# EAGLE schematic replica61 (EAGLE 7.4.0)
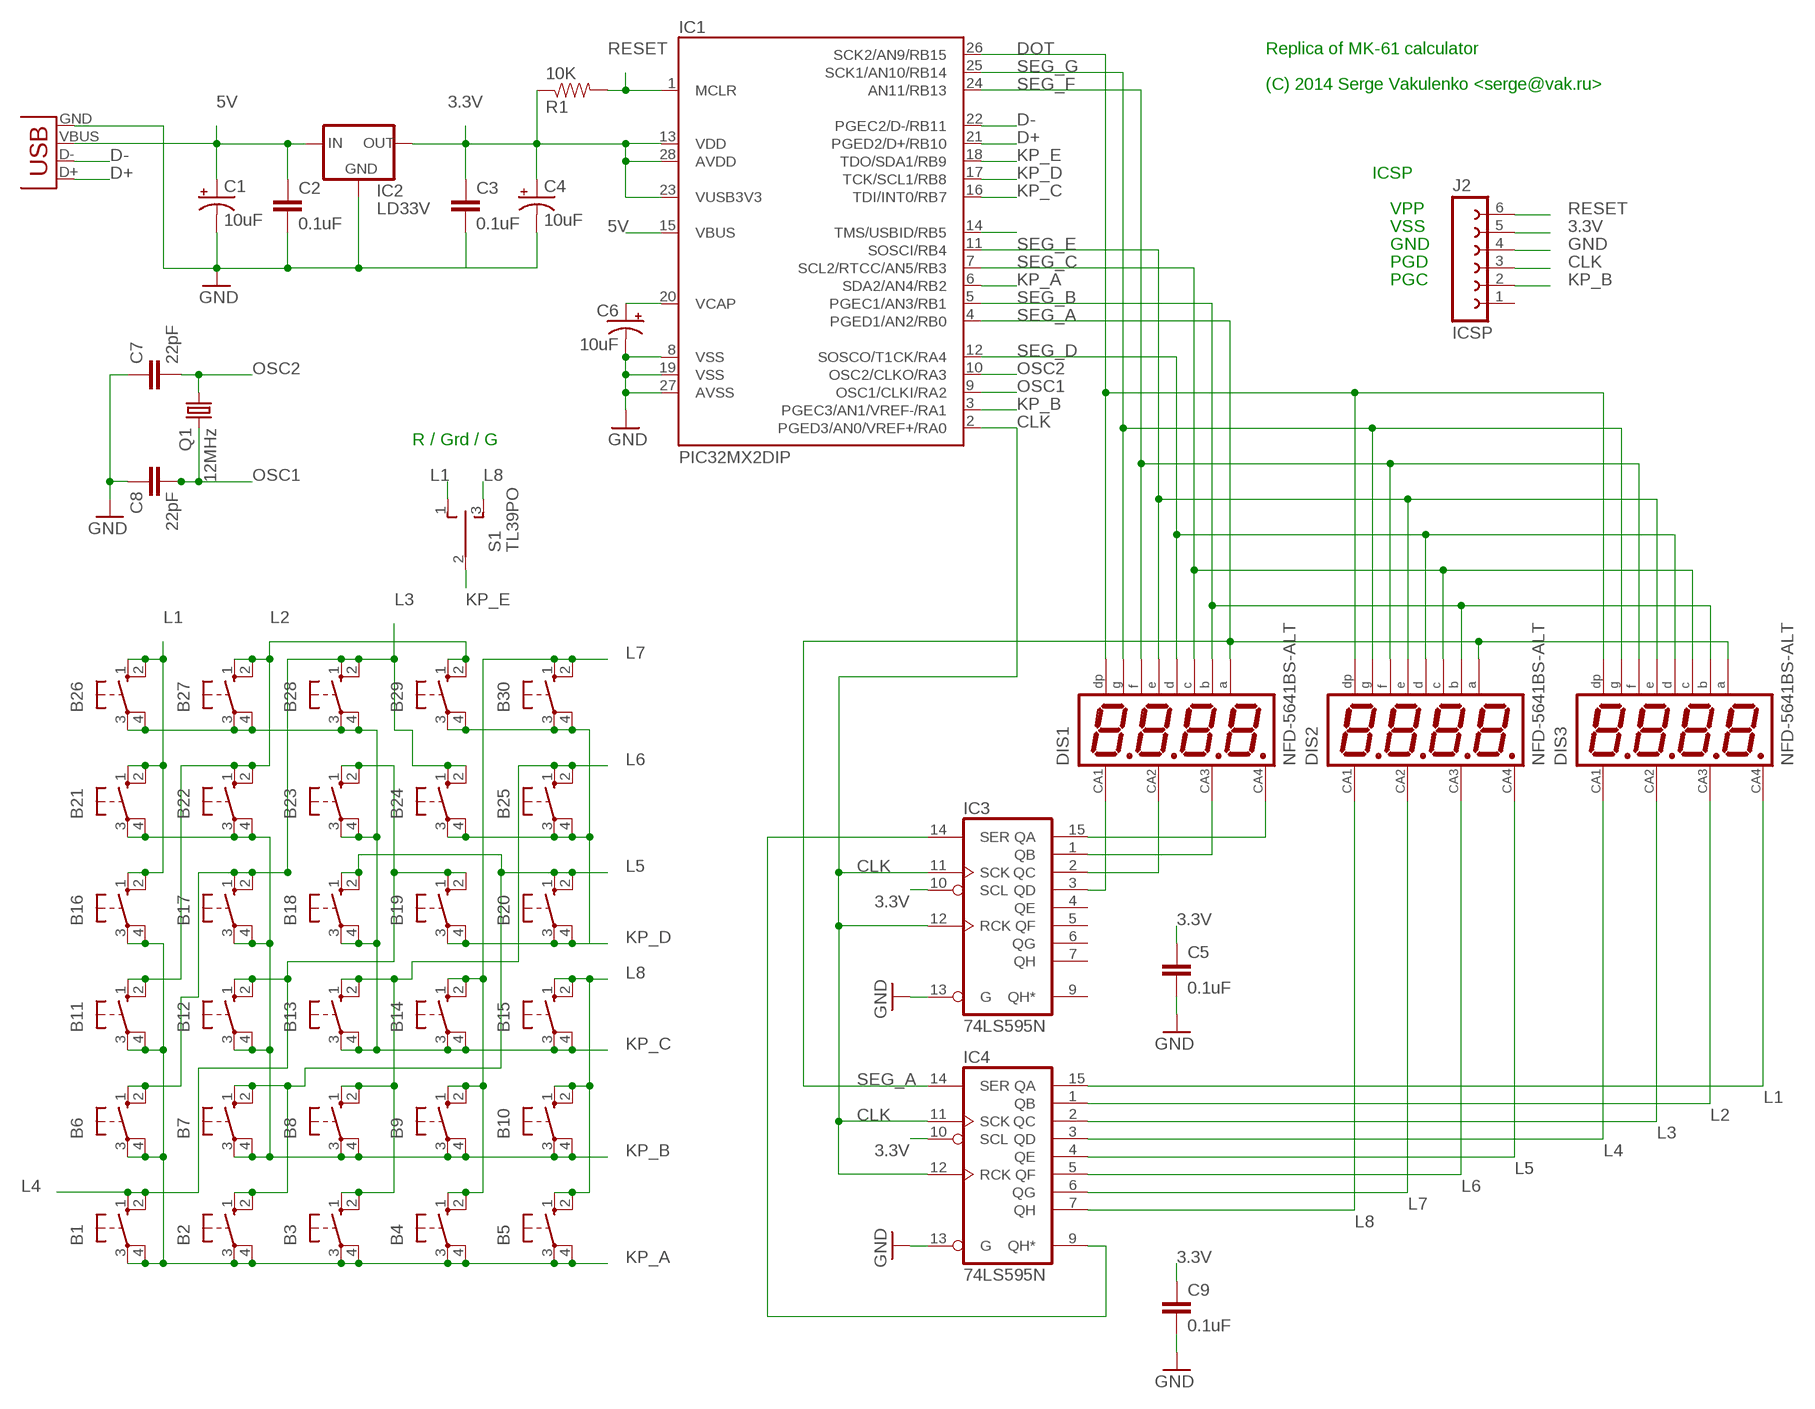
[diagram p0: schematic, sheet 1]

## Parts
B1  40-XX  [B3F-40XX]
B2  40-XX  [B3F-40XX]
B3  40-XX  [B3F-40XX]
B4  40-XX  [B3F-40XX]
B5  40-XX  [B3F-40XX]
B6  40-XX  [B3F-40XX]
B7  40-XX  [B3F-40XX]
B8  40-XX  [B3F-40XX]
B9  40-XX  [B3F-40XX]
B10  40-XX  [B3F-40XX]
B11  40-XX  [B3F-40XX]
B12  40-XX  [B3F-40XX]
B13  40-XX  [B3F-40XX]
B14  40-XX  [B3F-40XX]
B15  40-XX  [B3F-40XX]
B16  40-XX  [B3F-40XX]
B17  40-XX  [B3F-40XX]
B18  40-XX  [B3F-40XX]
B19  40-XX  [B3F-40XX]
B20  40-XX  [B3F-40XX]
B21  40-XX  [B3F-40XX]
B22  40-XX  [B3F-40XX]
B23  40-XX  [B3F-40XX]
B24  40-XX  [B3F-40XX]
B25  40-XX  [B3F-40XX]
B26  40-XX  [B3F-40XX]
B27  40-XX  [B3F-40XX]
B28  40-XX  [B3F-40XX]
B29  40-XX  [B3F-40XX]
B30  40-XX  [B3F-40XX]
C1  10uF  CAP_POLPTH2  [CPOL-RADIAL-10UF-25V]
C2  0.1uF  CAPPTH  [CAP-PTH-SMALL]
C3  0.1uF  CAPPTH1  [CAP-PTH-5MM]
C4  10uF  CAP_POLPTH2  [CPOL-RADIAL-10UF-25V]
C5  0.1uF  CAPPTH1  [CAP-PTH-5MM]
C6  10uF  CAP_POLPTH2  [CPOL-RADIAL-10UF-25V]
C7  22pF  CAPPTH  [CAP-PTH-SMALL]
C8  22pF  CAPPTH  [CAP-PTH-SMALL]
C9  0.1uF  CAPPTH1  [CAP-PTH-5MM]
DIS1  NFD-5641BS-ALT  [NFD-5641]
DIS2  NFD-5641BS-ALT  [NFD-5641]
DIS3  NFD-5641BS-ALT  [NFD-5641]
IC1  PIC32MX2DIP  [DIL28-3]
IC2  LD33V  V_REG_78XXSIDE  [78XXL]
IC3  74LS595N  [DIL16]
IC4  74LS595N  [DIL16]
J2  ICSP  FE06-1  [FE06]
Q1  12MHz  CRYSTALHC49US  [HC49US]
R1  10K  RESISTORPTH1  [AXIAL-0.3]
S1  TL39PO  [TL3XPO]
X1  USBPTH  [USB-B-PTH]

## Nets
3.3V: C3.1 C4.1(+) C5.1 C9.1 IC1.13(VDD) IC1.23(VUSB3V3) IC1.28(AVDD) IC2.OUT IC3.10(SCL) IC4.10(SCL) J2.5 R1.P$1
5V: C1.1(+) C2.1 IC1.15(VBUS) IC2.IN X1.VBUS
CLK: IC1.2(PGED3/AN0/VREF+/RA0) IC3.11(SCK) IC3.12(RCK) IC4.11(SCK) IC4.12(RCK) J2.3
D+: IC1.21(PGED2/D+/RB10) X1.D+
D-: IC1.22(PGEC2/D-/RB11) X1.D-
DOT: DIS1.P$3 DIS2.P$3 DIS3.P$3 IC1.26(SCK2/AN9/RB15)
GND: C1.2(-) C2.2 C3.2 C4.2(-) C5.2 C6.2(-) C7.1 C8.1 C9.2 IC1.8(VSS) IC1.19(VSS) IC1.27(AVSS) IC2.GND IC3.13(G) IC4.13(G) J2.4 X1.GND
KP_A: B1.3(P) B1.4(P1) B2.3(P) B2.4(P1) B3.3(P) B3.4(P1) B4.3(P) B4.4(P1) B5.3(P) B5.4(P1) B6.3(P) B6.4(P1) B11.3(P) B11.4(P1) B16.3(P) B16.4(P1) IC1.6(SDA2/AN4/RB2)
KP_B: B7.3(P) B7.4(P1) B8.3(P) B8.4(P1) B9.3(P) B9.4(P1) B10.3(P) B10.4(P1) B12.3(P) B12.4(P1) B17.3(P) B17.4(P1) B21.3(P) B21.4(P1) B22.3(P) B22.4(P1) IC1.3(PGEC3/AN1/VREF-/RA1) J2.2
KP_C: B13.3(P) B13.4(P1) B14.3(P) B14.4(P1) B15.3(P) B15.4(P1) B18.3(P) B18.4(P1) B23.3(P) B23.4(P1) B26.3(P) B26.4(P1) B27.3(P) B27.4(P1) B28.3(P) B28.4(P1) IC1.16(TDI/INT0/RB7)
KP_D: B19.3(P) B19.4(P1) B20.3(P) B20.4(P1) B24.3(P) B24.4(P1) B25.3(P) B25.4(P1) B29.3(P) B29.4(P1) B30.3(P) B30.4(P1) IC1.17(TCK/SCL1/RB8)
KP_E: IC1.18(TDO/SDA1/RB9) S1.2(P)
L1: B16.1(S) B16.2(S1) B21.1(S) B21.2(S1) B26.1(S) B26.2(S1) DIS3.P$6 IC4.15(QA) S1.1(O)
L2: B11.1(S) B11.2(S1) B22.1(S) B22.2(S1) B27.1(S) B27.2(S1) B29.1(S) B29.2(S1) DIS3.P$8 IC4.1(QB)
L3: B6.1(S) B6.2(S1) B17.1(S) B17.2(S1) B24.1(S) B24.2(S1) B28.1(S) B28.2(S1) DIS3.P$9 IC4.2(QC)
L4: B1.1(S) B1.2(S1) B12.1(S) B12.2(S1) B19.1(S) B19.2(S1) DIS3.P$12 IC4.3(QD)
L5: B2.1(S) B2.2(S1) B7.1(S) B7.2(S1) B18.1(S) B18.2(S1) B20.1(S) B20.2(S1) DIS2.P$6 IC4.4(QE)
L6: B3.1(S) B3.2(S1) B8.1(S) B8.2(S1) B13.1(S) B13.2(S1) B25.1(S) B25.2(S1) DIS2.P$8 IC4.5(QF)
L7: B4.1(S) B4.2(S1) B9.1(S) B9.2(S1) B14.1(S) B14.2(S1) B30.1(S) B30.2(S1) DIS2.P$9 IC4.6(QG)
L8: B5.1(S) B5.2(S1) B10.1(S) B10.2(S1) B15.1(S) B15.2(S1) DIS2.P$12 IC4.7(QH) S1.3(S)
N$1: B23.1(S) B23.2(S1)
N$10: DIS1.P$6 IC3.15(QA)
N$11: DIS1.P$8 IC3.1(QB)
N$12: DIS1.P$9 IC3.2(QC)
N$13: DIS1.P$12 IC3.3(QD)
N$14: IC3.14(SER) IC4.9(QH*)
OSC1: C8.2 IC1.9(OSC1/CLKI/RA2) Q1.2
OSC2: C7.2 IC1.10(OSC2/CLKO/RA3) Q1.1
RB5: IC1.14(TMS/USBID/RB5)
RESET: IC1.1(MCLR) J2.6 R1.P$2
SEG_A: DIS1.P$11 DIS2.P$11 DIS3.P$11 IC1.4(PGED1/AN2/RB0) IC4.14(SER)
SEG_B: DIS1.P$7 DIS2.P$7 DIS3.P$7 IC1.5(PGEC1/AN3/RB1)
SEG_C: DIS1.P$4 DIS2.P$4 DIS3.P$4 IC1.7(SCL2/RTCC/AN5/RB3)
SEG_D: DIS1.P$2 DIS2.P$2 DIS3.P$2 IC1.12(SOSCO/T1CK/RA4)
SEG_E: DIS1.P$1 DIS2.P$1 DIS3.P$1 IC1.11(SOSCI/RB4)
SEG_F: DIS1.P$10 DIS2.P$10 DIS3.P$10 IC1.24(AN11/RB13)
SEG_G: DIS1.P$5 DIS2.P$5 DIS3.P$5 IC1.25(SCK1/AN10/RB14)
VCAP: C6.1(+) IC1.20(VCAP)
Unconnected: IC3.4(QE) IC3.5(QF) IC3.6(QG) IC3.7(QH) IC3.9(QH*) J2.1

## Notes on the sheet
- Replica of MK-61 calculator
- (C) 2014 Serge Vakulenko <serge@vak.ru>
- ICSP
- VPP
- VSS
- GND
- PGD
- PGC
- R / Grd / G

## Power pins joined to a net without a drawn wire
GND: IC3.8(GND) IC4.8(GND)
VCC: IC3.16(VCC) IC4.16(VCC)

## Library data of the parts
B1-B30 = switch-omron:40-XX: OMRON SWITCH; MF: OMRON COMPONENTS USA; MPN: B3F-4000; OC_FARNELL: 176434; OC_NEWARK: 36K3105
C1 C4 C6 = SparkFun:CAP_POL: Capacitor Polarized These are standard SMD and PTH capacitors. Normally 10uF, 47uF, and 100uF in electrolytic and tantalum varieties. Always verify the external diameter of the through hole cap, it varies with capacity, voltage, and manufacturer. The EIA devices should be standard.
C2 C3 C5 C7-C9 = SparkFun:CAP: Capacitor Standard 0603 ceramic capacitor, and 0.1" leaded capacitor.
DIS1-DIS3 = display-nfd:NFD-5641BS-ALT: Four Digit 0.56" CA Seven-Segment LED Display Futurlec part number: 7FR5641BS Created by RobG
IC1 = Vak:PIC32MX2
IC2 = SparkFun:V_REG_78XX: Voltage Regulator Standard 7805 5V regulator. IGO (Input Ground Output). Spark Fun Electronics SKU : COM-00107
IC3 IC4 = 74xx-us:74*595: 8-bit SHIFT REGISTER, output latch
J2 = con-lsta:FE06-1: FEMALE HEADER
Q1 = SparkFun:CRYSTAL: Crystals Various standard crystals. Proven footprints. Spark Fun Electronics SKU : COM-00534
R1 = SparkFun:RESISTOR: Resistor Basic schematic elements and footprints for 0603, 1206, and PTH 1/10th watt (small) resistors.
S1 = switch:TL39PO: TINY SWITCH ON OFF ON Source: http://www2.produktinfo.conrad.com/datenblaetter/700000-724999/705152-da-01-de-Subminiaturschalter_TL_36YO.pdf
X1 = SparkFun:USB: USB Connectors USB-B-PTH is fully proven SKU : PRT-00139 USB-miniB is fully proven SKU : PRT-00587 USB-A-PCB is untested. USB-A-H is throughly reviewed, but untested. Spark Fun Electronics SKU : PRT-00437 USB-B-SMT is throughly reviewed, but untested. Needs silkscreen touching up. USB-A-S has not been used/tested USB-MB-H has not been used/tested